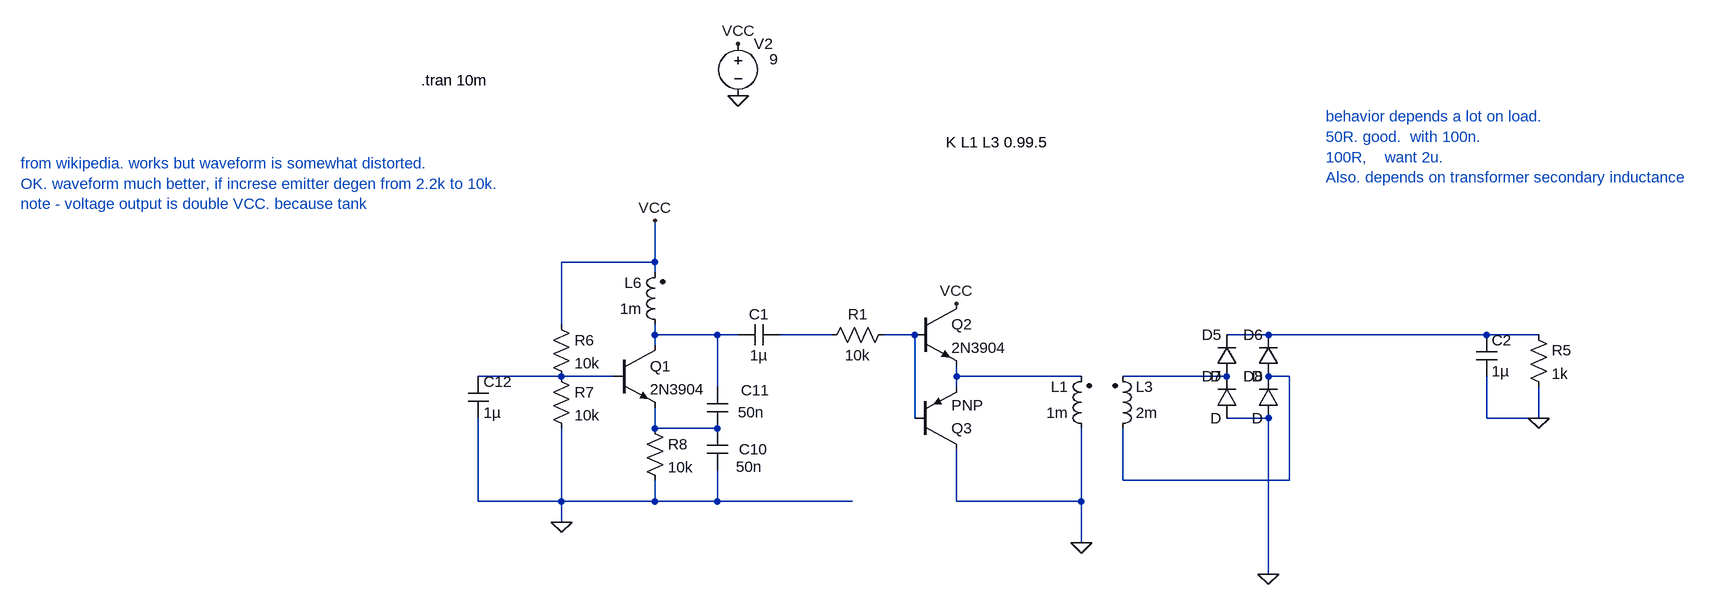
[diagram p0: schematic Draft102.asc]
Draft102.asc, the LTspice schematic file:
Version 4
SHEET 1 5720 1740
WIRE -1008 -224 -1008 -288
WIRE -1008 -224 -1152 -224
WIRE -1008 -208 -1008 -224
WIRE -1152 -128 -1152 -224
WIRE -1008 -112 -1008 -128
WIRE -912 -112 -1008 -112
WIRE -880 -112 -912 -112
WIRE -736 -112 -816 -112
WIRE -608 -112 -656 -112
WIRE -64 -112 -128 -112
WIRE 272 -112 -64 -112
WIRE 352 -112 272 -112
WIRE -1008 -96 -1008 -112
WIRE -1152 -48 -1280 -48
WIRE -1072 -48 -1152 -48
WIRE -544 -48 -544 -64
WIRE -352 -48 -544 -48
WIRE -128 -48 -288 -48
WIRE -32 -48 -64 -48
WIRE -912 -32 -912 -112
WIRE -544 -32 -544 -48
WIRE -608 16 -608 -112
WIRE -64 16 -128 16
WIRE 272 16 272 -48
WIRE 352 16 352 -32
WIRE 352 16 272 16
WIRE -1008 32 -1008 0
WIRE -912 32 -1008 32
WIRE -288 112 -288 32
WIRE -32 112 -32 -48
WIRE -32 112 -288 112
WIRE -1280 144 -1280 16
WIRE -1152 144 -1152 32
WIRE -1152 144 -1280 144
WIRE -1008 144 -1008 112
WIRE -1008 144 -1152 144
WIRE -912 144 -912 96
WIRE -912 144 -1008 144
WIRE -704 144 -912 144
WIRE -544 144 -544 64
WIRE -352 144 -352 32
WIRE -352 144 -544 144
WIRE -1152 176 -1152 144
WIRE -352 208 -352 144
WIRE -64 256 -64 16
FLAG -880 -480 0
FLAG -880 -560 VCC
FLAG 352 16 0
FLAG -64 256 0
FLAG -1008 -288 VCC
FLAG -1152 176 0
FLAG -544 -160 VCC
FLAG -352 208 0
SYMBOL voltage -880 -576 R0
WINDOW 123 0 0 Left 0
WINDOW 39 0 0 Left 0
WINDOW 3 48 40 Left 2
SYMATTR Value 9
SYMATTR InstName V2
SYMBOL ind2 -304 48 M180
WINDOW 0 36 80 Left 2
WINDOW 3 36 40 Left 2
SYMATTR InstName L3
SYMATTR Value 2m
SYMATTR Type ind
SYMBOL diode -112 -48 R180
WINDOW 0 24 64 Left 2
WINDOW 3 24 0 Left 2
SYMATTR InstName D5
SYMBOL diode -48 -48 R180
WINDOW 0 24 64 Left 2
WINDOW 3 24 0 Left 2
SYMATTR InstName D6
SYMBOL diode -112 16 R180
WINDOW 0 24 64 Left 2
WINDOW 3 24 0 Left 2
SYMATTR InstName D7
SYMBOL diode -48 16 R180
WINDOW 0 24 64 Left 2
WINDOW 3 24 0 Left 2
SYMATTR InstName D8
SYMBOL cap 256 -112 R0
SYMATTR InstName C2
SYMATTR Value 1µ
SYMBOL res 336 -128 R0
SYMATTR InstName R5
SYMATTR Value 1k
SYMBOL ind2 -992 -112 R180
WINDOW 0 36 80 Left 2
WINDOW 3 36 40 Left 2
SYMATTR InstName L6
SYMATTR Value 1m
SYMATTR Type ind
SYMBOL res -1168 -144 R0
SYMATTR InstName R6
SYMATTR Value 10k
SYMBOL res -1168 -64 R0
SYMATTR InstName R7
SYMATTR Value 10k
SYMBOL npn -1072 -96 R0
SYMATTR InstName Q1
SYMATTR Value 2N3904
SYMBOL cap -928 32 R0
WINDOW 0 49 32 Left 2
WINDOW 3 45 59 Left 2
SYMATTR InstName C10
SYMATTR Value 50n
SYMBOL cap -928 -32 R0
WINDOW 0 52 5 Left 2
WINDOW 3 48 39 Left 2
SYMATTR InstName C11
SYMATTR Value 50n
SYMBOL res -1024 16 R0
SYMATTR InstName R8
SYMATTR Value 10k
SYMBOL cap -1296 -48 R0
SYMATTR InstName C12
SYMATTR Value 1µ
SYMBOL npn -608 -160 R0
SYMATTR InstName Q2
SYMATTR Value 2N3904
SYMBOL pnp -608 64 M180
SYMATTR InstName Q3
SYMBOL ind2 -336 48 R180
WINDOW 0 36 80 Left 2
WINDOW 3 36 40 Left 2
SYMATTR InstName L1
SYMATTR Value 1m
SYMATTR Type ind
SYMBOL res -640 -128 R90
WINDOW 0 0 56 VBottom 2
WINDOW 3 32 56 VTop 2
SYMATTR InstName R1
SYMATTR Value 10k
SYMBOL cap -816 -128 R90
WINDOW 0 0 32 VBottom 2
WINDOW 3 32 32 VTop 2
SYMATTR InstName C1
SYMATTR Value 1µ
TEXT -560 -408 Left 2 !K L1 L3 0.99.5
TEXT -1368 -504 Left 2 !.tran 10m
TEXT 24 -448 Left 2 ;behavior depends a lot on load. \n50R. good.  with 100n. \n100R,    want 2u.\nAlso. depends on transformer secondary inductance
TEXT -1984 -376 Left 2 ;from wikipedia. works but waveform is somewhat distorted.\nOK. waveform much better, if increse emitter degen from 2.2k to 10k.\nnote - voltage output is double VCC. because tank

The netlist it stands for:
* Draft102.asc
V2 VCC 0 9
L3 N008 N007 2m
D5 N007 N004 D
D6 N008 N004 D
D7 0 N007 D
D8 0 N008 D
C2 N004 0 1µ
R5 N004 0 1k
L6 N001 VCC 1m
R6 VCC N005 10k
R7 N005 0 10k
Q1 N001 N005 N009 0 2N3904
C10 N009 0 50n
C11 N001 N009 50n
R8 N009 0 10k
C12 N005 0 1µ
Q2 VCC N003 N006 0 2N3904
Q3 0 N003 N006 0 PNP
L1 0 N006 1m
R1 N003 N002 10k
C1 N002 N001 1µ
.model D D
.lib standard.dio
.model NPN NPN
.model PNP PNP
.lib standard.bjt
K L1 L3 0.99.5
.tran 10m
* behavior depends a lot on load.
* 50R. good.  with 100n.
* 100R,    want 2u.
* Also. depends on transformer secondary inductance
* from wikipedia. works but waveform is somewhat distorted.
* OK. waveform much better, if increse emitter degen from 2.2k to 10k.
* note - voltage output is double VCC. because tank
.backanno
.end